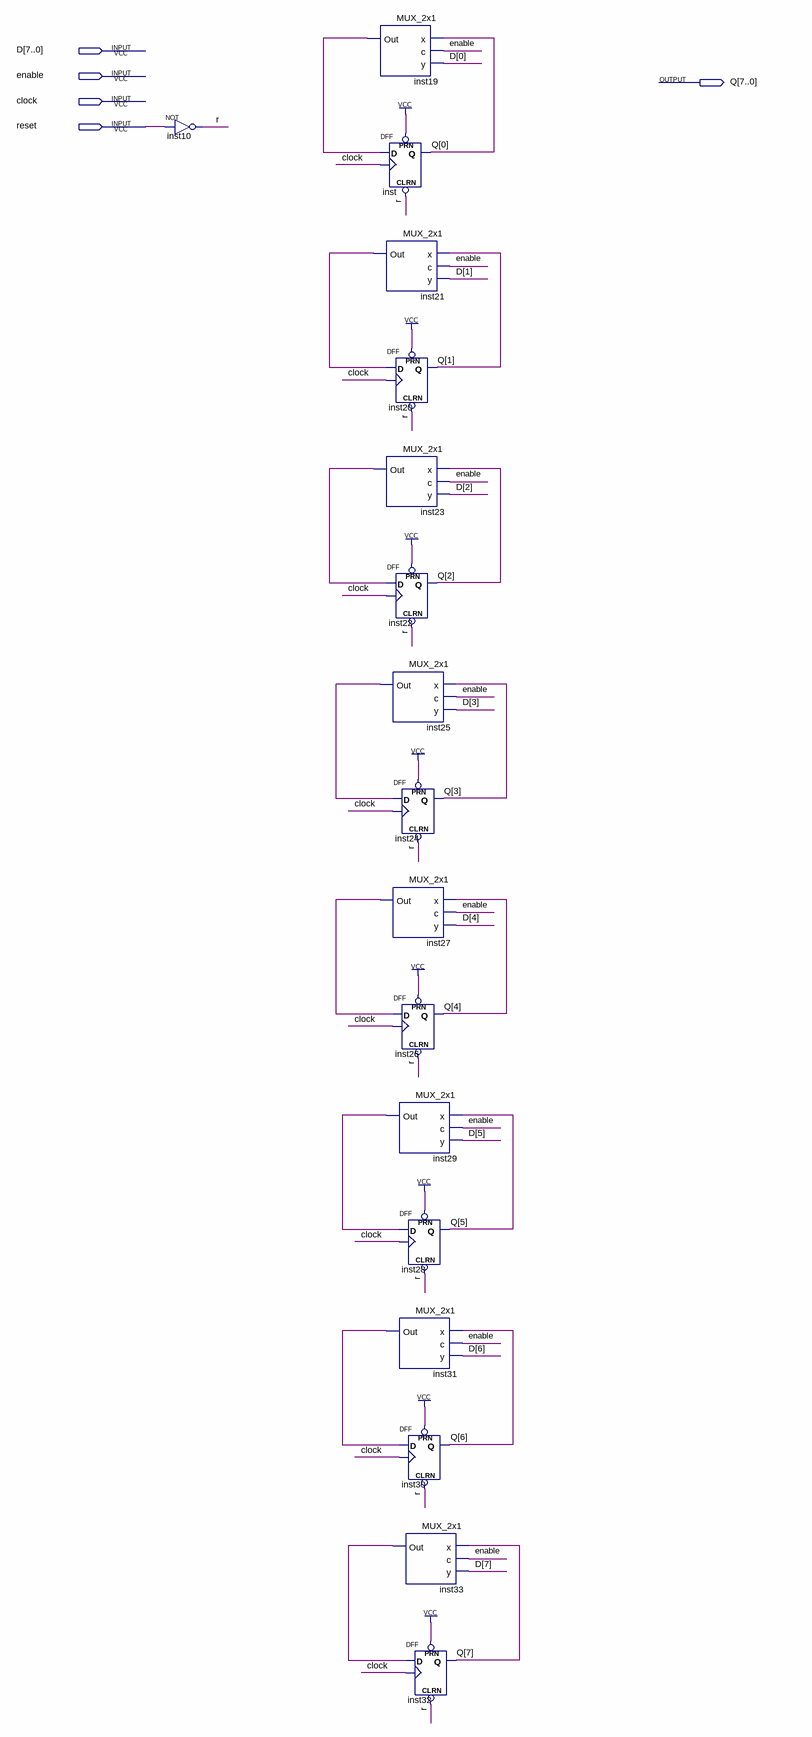
[diagram p0: schematic sheet]
// Quartus schematic REGISTER_ENABLE.bdf as structural Verilog: 17 symbols, 5 pins
module REGISTER_ENABLE (
  input  [7:0] D,
  input  enable,
  input  clock,
  input  reset,
  output [7:0] Q
);

  wire inst19_out, inst21_out, inst23_out, inst25_out, inst27_out, inst29_out, inst31_out, inst33_out, r;

  not inst10 (r, reset);
  MUX_2x1 inst19 (.x(Q[0]), .c(enable), .y(D[0]), .Out(inst19_out));
  MUX_2x1 inst21 (.x(Q[1]), .c(enable), .y(D[1]), .Out(inst21_out));
  MUX_2x1 inst23 (.x(Q[2]), .c(enable), .y(D[2]), .Out(inst23_out));
  DFF inst (.CLRN(r), .CLK(clock), .D(inst19_out), .PRN(1'b1), .Q(Q[0]));
  DFF inst20 (.CLRN(r), .CLK(clock), .D(inst21_out), .PRN(1'b1), .Q(Q[1]));
  DFF inst22 (.CLRN(r), .CLK(clock), .D(inst23_out), .PRN(1'b1), .Q(Q[2]));
  MUX_2x1 inst25 (.x(Q[3]), .c(enable), .y(D[3]), .Out(inst25_out));
  DFF inst24 (.CLRN(r), .CLK(clock), .D(inst25_out), .PRN(1'b1), .Q(Q[3]));
  MUX_2x1 inst27 (.x(Q[4]), .c(enable), .y(D[4]), .Out(inst27_out));
  DFF inst26 (.CLRN(r), .CLK(clock), .D(inst27_out), .PRN(1'b1), .Q(Q[4]));
  MUX_2x1 inst29 (.x(Q[5]), .c(enable), .y(D[5]), .Out(inst29_out));
  DFF inst28 (.CLRN(r), .CLK(clock), .D(inst29_out), .PRN(1'b1), .Q(Q[5]));
  MUX_2x1 inst31 (.x(Q[6]), .c(enable), .y(D[6]), .Out(inst31_out));
  DFF inst30 (.CLRN(r), .CLK(clock), .D(inst31_out), .PRN(1'b1), .Q(Q[6]));
  MUX_2x1 inst33 (.x(Q[7]), .c(enable), .y(D[7]), .Out(inst33_out));
  DFF inst32 (.CLRN(r), .CLK(clock), .D(inst33_out), .PRN(1'b1), .Q(Q[7]));
endmodule
